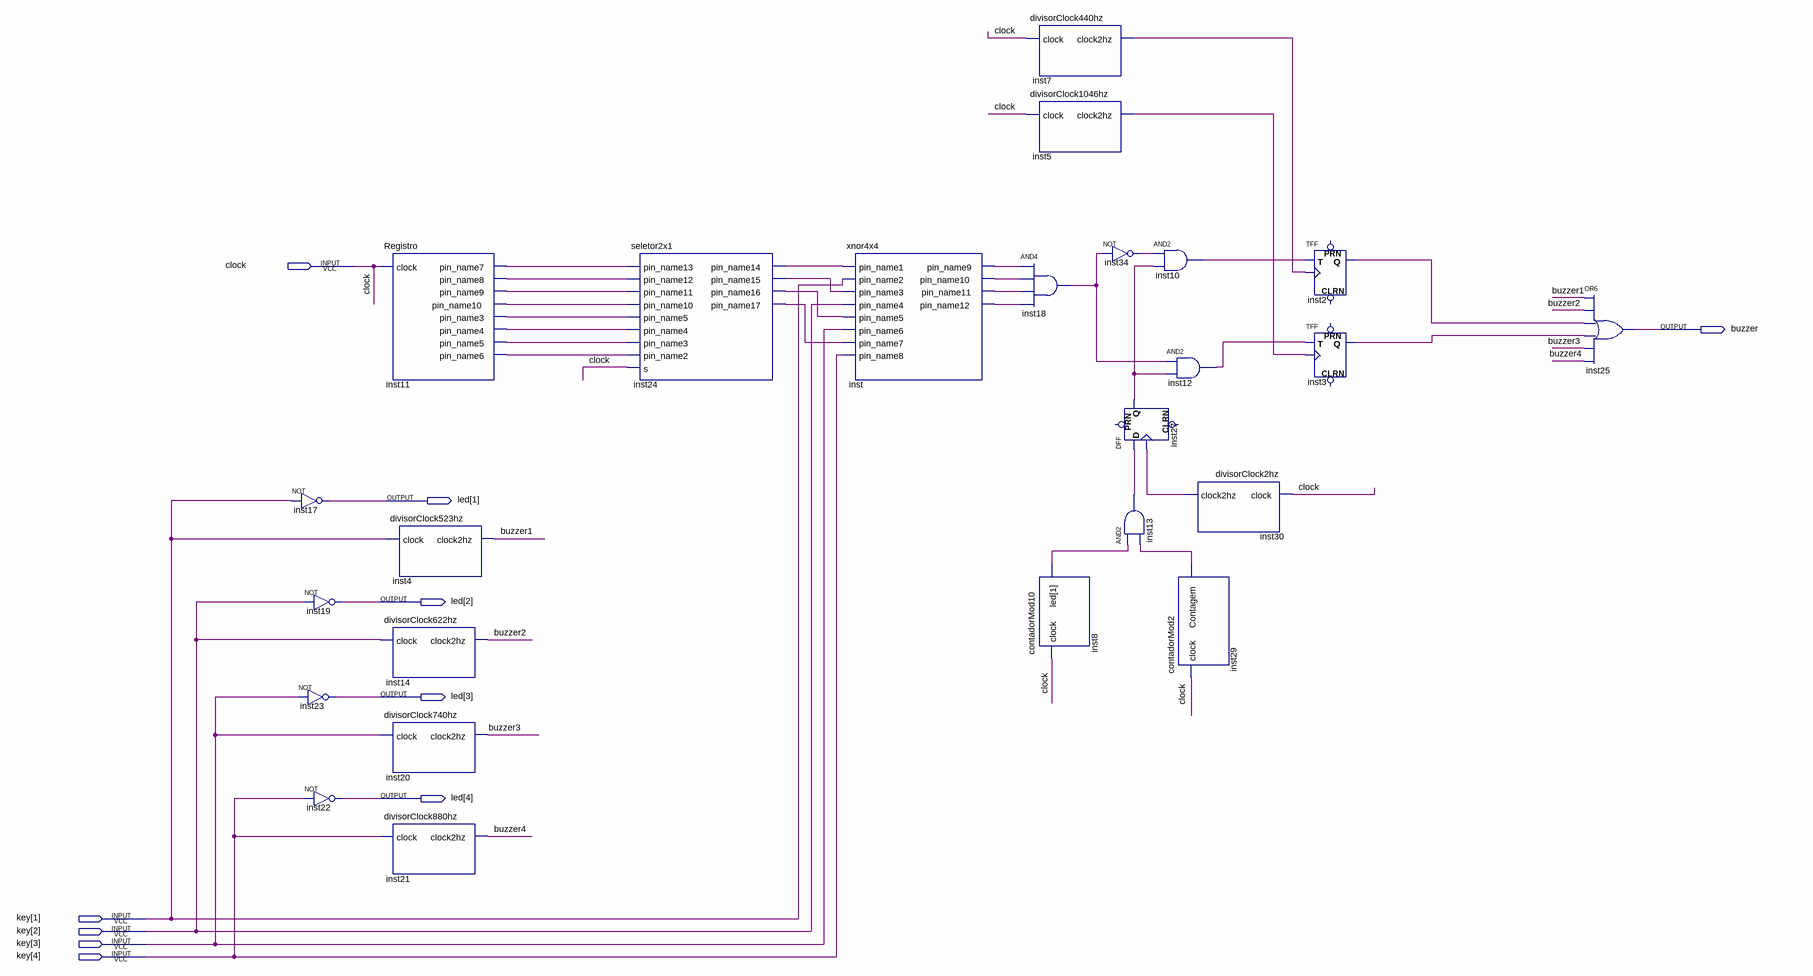
[diagram p0: schematic sheet]
// Quartus schematic pprojeto1.bdf as structural Verilog: 25 symbols, 10 pins
module pprojeto1 (
  input  clock,
  input  [4:1] key,
  output buzzer,
  output [4:1] led
);

  wire buzzer1, buzzer2, buzzer3, buzzer4, inst2_q, inst3_q, inst5_clock2hz, inst7_clock2hz, inst8_led,
       inst10_out, inst11_pin_name3, inst11_pin_name4, inst11_pin_name5, inst11_pin_name6, inst11_pin_name7,
       inst11_pin_name8, inst11_pin_name9, inst11_pin_name10, inst12_out, inst13_out, inst18_out,
       inst24_pin_name14, inst24_pin_name15, inst24_pin_name16, inst24_pin_name17, inst27_q, inst29_contagem,
       inst30_clock2hz, inst34_out, inst_pin_name9, inst_pin_name10, inst_pin_name11, inst_pin_name12;

  not inst17 (led[1], key[1]);
  not inst19 (led[2], key[2]);
  not inst23 (led[3], key[3]);
  not inst22 (led[4], key[4]);
  Registro inst11 (
    .clock(clock), .pin_name7(inst11_pin_name7), .pin_name8(inst11_pin_name8), .pin_name9(inst11_pin_name9),
    .pin_name10(inst11_pin_name10), .pin_name3(inst11_pin_name3), .pin_name4(inst11_pin_name4),
    .pin_name5(inst11_pin_name5), .pin_name6(inst11_pin_name6));
  divisorClock523hz inst4 (.clock(key[1]), .clock2hz(buzzer1));
  divisorClock622hz inst14 (.clock(key[2]), .clock2hz(buzzer2));
  divisorClock740hz inst20 (.clock(key[3]), .clock2hz(buzzer3));
  divisorClock880hz inst21 (.clock(key[4]), .clock2hz(buzzer4));
  seletor2x1 inst24 (
    .pin_name13(inst11_pin_name7), .pin_name12(inst11_pin_name8), .pin_name11(inst11_pin_name9),
    .pin_name10(inst11_pin_name10), .pin_name5(inst11_pin_name3), .pin_name4(inst11_pin_name4),
    .pin_name3(inst11_pin_name5), .pin_name2(inst11_pin_name6), .s(clock), .pin_name14(inst24_pin_name14),
    .pin_name15(inst24_pin_name15), .pin_name16(inst24_pin_name16), .pin_name17(inst24_pin_name17));
  xnor4x4 inst (
    .pin_name1(inst24_pin_name14), .pin_name2(key[1]), .pin_name3(inst24_pin_name15), .pin_name4(key[2]),
    .pin_name5(inst24_pin_name16), .pin_name6(key[3]), .pin_name7(inst24_pin_name17), .pin_name8(key[4]),
    .pin_name9(inst_pin_name9), .pin_name10(inst_pin_name10), .pin_name11(inst_pin_name11),
    .pin_name12(inst_pin_name12));
  and inst18 (inst18_out, inst_pin_name9, inst_pin_name10, inst_pin_name11, inst_pin_name12);
  divisorClock440hz inst7 (.clock(clock), .clock2hz(inst7_clock2hz));
  divisorClock1046hz inst5 (.clock(clock), .clock2hz(inst5_clock2hz));
  contadorMod10 inst8 (.clock(clock), .led(inst8_led));
  not inst34 (inst34_out, inst18_out);
  DFF inst27 (.CLK(inst30_clock2hz), .D(inst13_out), .Q(inst27_q));  // open: CLRN, PRN
  and inst13 (inst13_out, inst8_led, inst29_contagem);
  and inst10 (inst10_out, inst34_out, inst27_q);
  and inst12 (inst12_out, inst18_out, inst27_q);
  contadorMod2 inst29 (.clock(clock), .Contagem(inst29_contagem));
  divisorClock2hz inst30 (.clock(clock), .clock2hz(inst30_clock2hz));
  TFF inst2 (.T(inst10_out), .CLK(inst7_clock2hz), .Q(inst2_q));  // open: PRN, CLRN
  TFF inst3 (.T(inst12_out), .CLK(inst5_clock2hz), .Q(inst3_q));  // open: PRN, CLRN
  or inst25 (buzzer, buzzer1, buzzer2, inst2_q, inst3_q, buzzer3, buzzer4);
endmodule
